# Altium schematic sheet Sheet1.SchDoc
size 420 x 297 mm; Scale: None
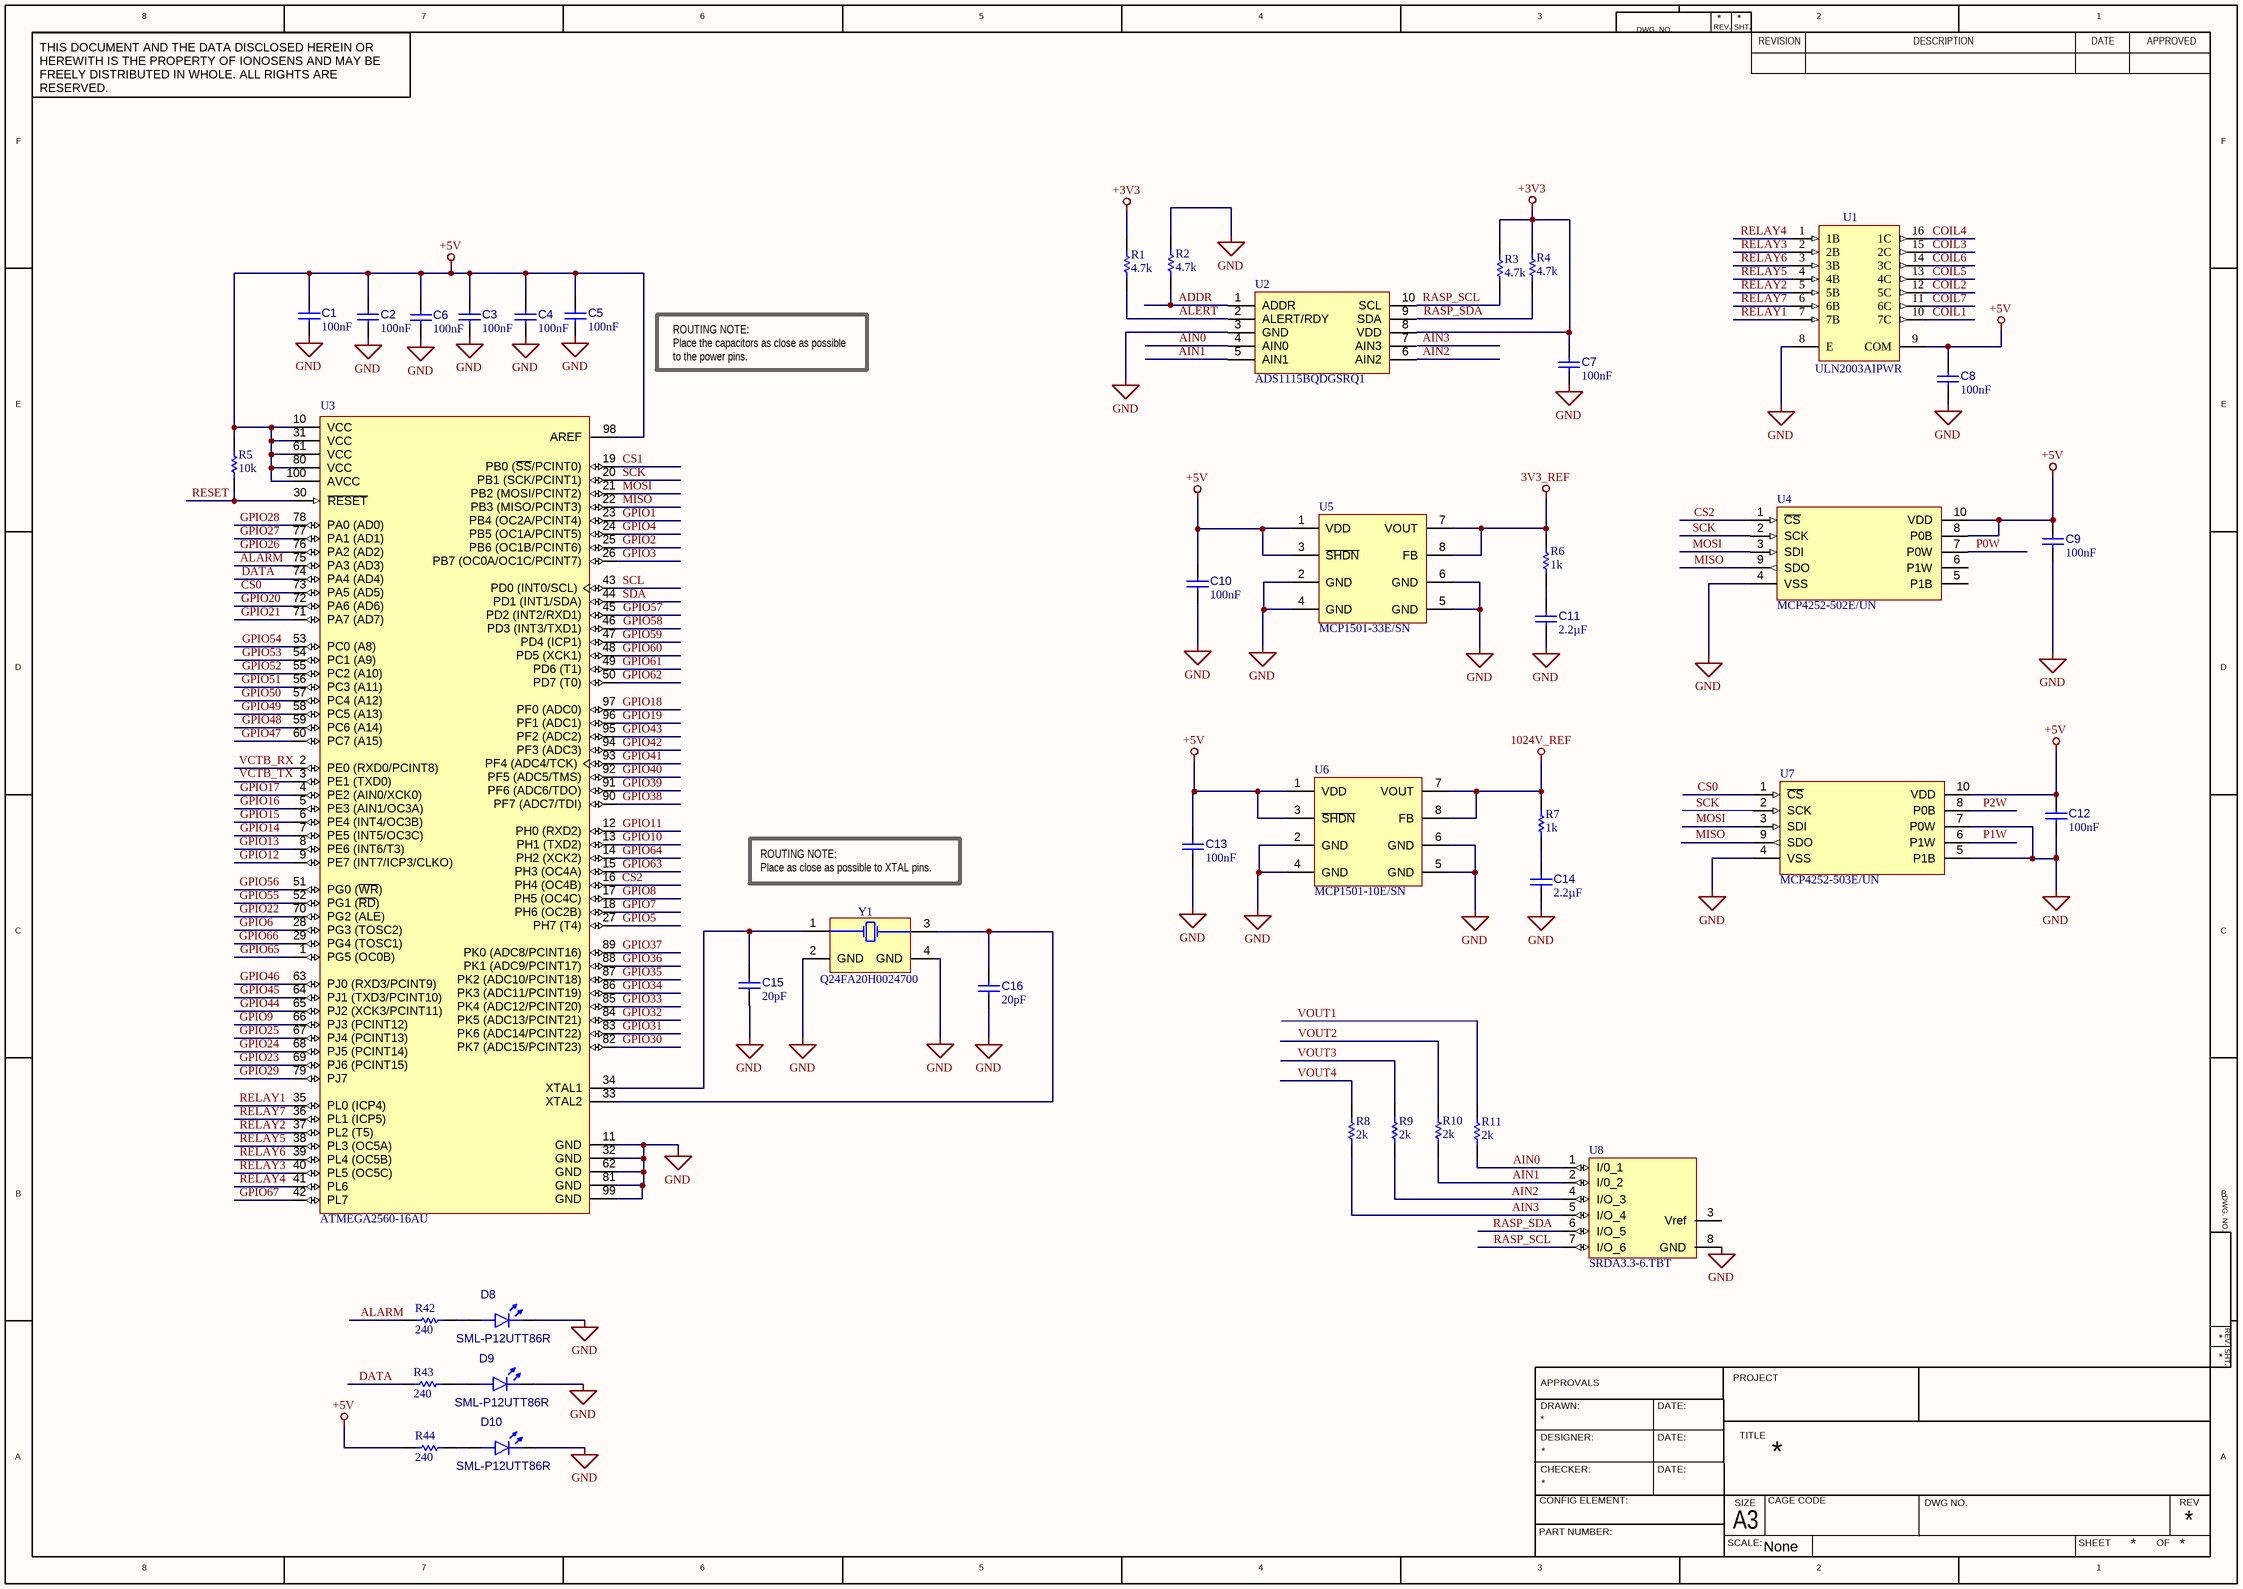
[diagram p0: Sheet1.SchDoc]

## Parts
C1  value 100nF  [CAPC1005X06M]  (hidden comment: CC0402JRX7R7BB104)
C2  value 100nF  [CAPC1005X06M]  (hidden comment: CC0402JRX7R7BB104)
C3  value 100nF  [CAPC1005X06M]  (hidden comment: CC0402JRX7R7BB104)
C4  value 100nF  [CAPC1005X06M]  (hidden comment: CC0402JRX7R7BB104)
C5  value 100nF  [CAPC1005X06M]  (hidden comment: CC0402JRX7R7BB104)
C6  value 100nF  [CAPC1005X06M]  (hidden comment: CC0402JRX7R7BB104)
C7  value 100nF  [CAPC1005X06M]  (hidden comment: CC0402JRX7R7BB104)
C8  value 100nF  [CAPC1005X06M]  (hidden comment: CC0402JRX7R7BB104)
C9  value 100nF  [CAPC1005X06M]  (hidden comment: CC0402JRX7R7BB104)
C10  value 100nF  [CAPC1005X06M]  (hidden comment: CC0402JRX7R7BB104)
C11  value 2.2µF  [CAPC2012X14M]  (hidden comment: AC0805KKX7R8BB225)
C12  value 100nF  [CAPC1005X06M]  (hidden comment: CC0402JRX7R7BB104)
C13  value 100nF  [CAPC1005X06M]  (hidden comment: CC0402JRX7R7BB104)
C14  value 2.2µF  [CAPC2012X14M]  (hidden comment: AC0805KKX7R8BB225)
C15  value 20pF  [CAPC1005X06M]  (hidden comment: CC0402JRNPO9BN200)
C16  value 20pF  [CAPC1005X06M]  (hidden comment: CC0402JRNPO9BN200)
D8  SML-P12UTT86R  [DIOC1005X02R]
D9  SML-P12UTT86R  [DIOC1005X02R]
D10  SML-P12UTT86R  [DIOC1005X02R]
R1  value 4.7k  [RESC1005X04M]  (hidden comment: AC0402FR-074K7L)
R2  value 4.7k  [RESC1005X04M]  (hidden comment: AC0402FR-074K7L)
R3  value 4.7k  [RESC1005X04M]  (hidden comment: AC0402FR-074K7L)
R4  value 4.7k  [RESC1005X04M]  (hidden comment: AC0402FR-074K7L)
R5  value 10k  [RESC1005X04M]  (hidden comment: AC0402FR-0710KL)
R6  value 1k  [RESC1005X04M]  (hidden comment: AC0402FR-071KL)
R7  value 1k  [RESC1005X04M]  (hidden comment: AC0402FR-071KL)
R8  value 2k  [RESC1005X04M]  (hidden comment: AC0402FR-072KL)
R9  value 2k  [RESC1005X04M]  (hidden comment: AC0402FR-072KL)
R10  value 2k  [RESC1005X04M]  (hidden comment: AC0402FR-072KL)
R11  value 2k  [RESC1005X04M]  (hidden comment: AC0402FR-072KL)
R42  value 240  [RESC1005X04M]  (hidden comment: AC0402FR-07240RL)
R43  value 240  [RESC1005X04M]  (hidden comment: AC0402FR-07240RL)
R44  value 240  [RESC1005X04M]  (hidden comment: AC0402FR-07240RL)
U1  ULN2003AIPWR  [TSOP65P640X120-16M]
U2  ADS1115BQDGSRQ1  [TSSOP50P490X110-10M]
U3  ATMEGA2560-16AU  [ATML-100A_M]
U4  MCP4252-502E/UN  [TSSOP50P490X110-10N]
U5  MCP1501-33E/SN  [SOIC127P600X175-8M]
U6  MCP1501-10E/SN  [SOIC127P600X175-8M]
U7  MCP4252-503E/UN  [TSSOP50P490X110-10N]
U8  SRDA3.3-6.TBT  [SOIC127P600X175-8M]
Y1  Q24FA20H0024700  [FA-20H]

## Nets
3V3_REF: R6.2 U5.7(VOUT) U5.8(FB)
1024V_REF: R7.2 U6.7(VOUT) U6.8(FB)
+3V3: C7.2 R1.2 R3.2 R4.2 U2.8(VDD)
+5V: C1.2 C2.2 C3.2 C4.2 C5.2 C6.2 C8.2 C9.2 C10.2 C12.2 C13.2 R5.2 R44.1 U1.9(COM) U3.10(VCC) U3.31(VCC) U3.61(VCC) U3.80(VCC) U3.98(AREF) U3.100(AVCC) U4.8(P0B) U4.10(VDD) U5.1(VDD) U5.3(~{SHDN}) U6.1(VDD) U6.3(~{SHDN}) U7.10(VDD)
GND: C1.1 C2.1 C3.1 C4.1 C5.1 C6.1 C7.1 C8.1 C9.1 C10.1 C11.1 C12.1 C13.1 C14.1 C15.1 C16.1 D8.1(K) D9.1(K) D10.1(K) R2.2 U1.8(E) U2.3(GND) U3.11(GND) U3.32(GND) U3.62(GND) U3.81(GND) U3.99(GND) U4.4(VSS) U5.2(GND) U5.4(GND) U5.5(GND) U5.6(GND) U6.2(GND) U6.4(GND) U6.5(GND) U6.6(GND) U7.4(VSS) U7.5(P1B) U7.7(P0W) U8.8(GND) Y1.2(GND) Y1.4(GND)
ADDR: R2.1 U2.1(ADDR)
AIN0: R11.2 U2.4(AIN0) U8.1(I/0_1)
AIN1: R10.1 U2.5(AIN1) U8.2(I/0_2)
AIN2: R9.1 U2.6(AIN2) U8.4(I/O_3)
AIN3: R8.1 U2.7(AIN3) U8.5(I/O_4)
ALARM: R42.1 U3.75(PA3_(AD3))
ALERT: R1.1 U2.2(ALERT/RDY)
COIL1: U1.10(7C)
COIL2: U1.12(5C)
COIL3: U1.15(2C)
COIL4: U1.16(1C)
COIL5: U1.13(4C)
COIL6: U1.14(3C)
COIL7: U1.11(6C)
CS0: U3.73(PA5_(AD5)) U7.1(~{CS})
CS1: U3.19(PB0_(~{SS}/PCINT0))
CS2: U3.16(PH4_(OC4B)) U4.1(~{CS})
DATA: R43.1 U3.74(PA4_(AD4))
GPIO1: U3.23(PB4_(OC2A/PCINT4))
GPIO2: U3.25(PB6_(OC1B/PCINT6))
GPIO3: U3.26(PB7_(OC0A/OC1C/PCINT7))
GPIO4: U3.24(PB5_(OC1A/PCINT5))
GPIO5: U3.27(PH7_(T4))
GPIO6: U3.28(PG3_(TOSC2))
GPIO7: U3.18(PH6_(OC2B))
GPIO8: U3.17(PH5_(OC4C))
GPIO9: U3.66(PJ3_(PCINT12))
GPIO10: U3.13(PH1_(TXD2))
GPIO11: U3.12(PH0_(RXD2))
GPIO12: U3.9(PE7_(INT7/ICP3/CLKO))
GPIO13: U3.8(PE6_(INT6/T3))
GPIO14: U3.7(PE5_(INT5/OC3C))
GPIO15: U3.6(PE4_(INT4/OC3B))
GPIO16: U3.5(PE3_(AIN1/OC3A))
GPIO17: U3.4(PE2_(AIN0/XCK0))
GPIO18: U3.97(PF0_(ADC0))
GPIO19: U3.96(PF1_(ADC1))
GPIO20: U3.72(PA6_(AD6))
GPIO21: U3.71(PA7_(AD7))
GPIO22: U3.70(PG2_(ALE))
GPIO23: U3.69(PJ6_(PCINT15))
GPIO24: U3.68(PJ5_(PCINT14))
GPIO25: U3.67(PJ4_(PCINT13))
GPIO26: U3.76(PA2_(AD2))
GPIO27: U3.77(PA1_(AD1))
GPIO28: U3.78(PA0_(AD0))
GPIO29: U3.79(PJ7)
GPIO30: U3.82(PK7_(ADC15/PCINT23))
GPIO31: U3.83(PK6_(ADC14/PCINT22))
GPIO32: U3.84(PK5_(ADC13/PCINT21))
GPIO33: U3.85(PK4_(ADC12/PCINT20))
GPIO34: U3.86(PK3_(ADC11/PCINT19))
GPIO35: U3.87(PK2_(ADC10/PCINT18))
GPIO36: U3.88(PK1_(ADC9/PCINT17))
GPIO37: U3.89(PK0_(ADC8/PCINT16))
GPIO38: U3.90(PF7_(ADC7/TDI))
GPIO39: U3.91(PF6_(ADC6/TDO))
GPIO40: U3.92(PF5_(ADC5/TMS))
GPIO41: U3.93(PF4_(ADC4/TCK))
GPIO42: U3.94(PF3_(ADC3))
GPIO43: U3.95(PF2_(ADC2))
GPIO44: U3.65(PJ2_(XCK3/PCINT11))
GPIO45: U3.64(PJ1_(TXD3/PCINT10))
GPIO46: U3.63(PJ0_(RXD3/PCINT9))
GPIO47: U3.60(PC7_(A15))
GPIO48: U3.59(PC6_(A14))
GPIO49: U3.58(PC5_(A13))
GPIO50: U3.57(PC4_(A12))
GPIO51: U3.56(PC3_(A11))
GPIO52: U3.55(PC2_(A10))
GPIO53: U3.54(PC1_(A9))
GPIO54: U3.53(PC0_(A8))
GPIO55: U3.52(PG1_(~{RD}))
GPIO56: U3.51(PG0_(~{WR}))
GPIO57: U3.45(PD2_(INT2/RXD1))
GPIO58: U3.46(PD3_(INT3/TXD1))
GPIO59: U3.47(PD4_(ICP1))
GPIO60: U3.48(PD5_(XCK1))
GPIO61: U3.49(PD6_(T1))
GPIO62: U3.50(PD7_(T0))
GPIO63: U3.15(PH3_(OC4A))
GPIO64: U3.14(PH2_(XCK2))
GPIO65: U3.1(PG5_(OC0B))
GPIO66: U3.29(PG4_(TOSC1))
GPIO67: U3.42(PL7)
MISO: U3.22(PB3_(MISO/PCINT3)) U4.9(SDO) U7.9(SDO)
MOSI: U3.21(PB2_(MOSI/PCINT2)) U4.3(SDI) U7.3(SDI)
P0W: U4.7(P0W)
P1W: U7.6(P1W)
P2W: U7.8(P0B)
RASP_SCL: R3.1 U2.10(SCL) U8.7(I/O_6)
RASP_SDA: R4.1 U2.9(SDA) U8.6(I/O_5)
RELAY1: U1.7(7B) U3.35(PL0_(ICP4))
RELAY2: U1.5(5B) U3.37(PL2_(T5))
RELAY3: U1.2(2B) U3.40(PL5_(OC5C))
RELAY4: U1.1(1B) U3.41(PL6)
RELAY5: U1.4(4B) U3.38(PL3_(OC5A))
RELAY6: U1.3(3B) U3.39(PL4_(OC5B))
RELAY7: U1.6(6B) U3.36(PL1_(ICP5))
RESET: R5.1 U3.30(~{RESET})
SCK: U3.20(PB1_(SCK/PCINT1)) U4.2(SCK) U7.2(SCK)
SCL: U3.43(PD0_(INT0/SCL))
SDA: U3.44(PD1_(INT1/SDA))
VCTB_RX: U3.2(PE0_(RXD0/PCINT8))
VCTB_TX: U3.3(PE1_(TXD0))
VOUT1: R11.1
VOUT2: R10.2
VOUT3: R9.2
VOUT4: R8.2
NetC11_2: C11.2 R6.1
NetC14_2: C14.2 R7.1
NetC15_2: C15.2 U3.34(XTAL1) Y1.1(X1)
NetC16_2: C16.2 U3.33(XTAL2) Y1.3(X2)
NetD8_2: D8.2(A) R42.2
NetD9_2: D9.2(A) R43.2
NetD10_2: D10.2(A) R44.2

Not connected (* = marked no-connect by the designer): U4 5(P1B) 6(P1W); U8 3(Vref)

## Notes on the sheet
- ROUTING NOTE:
  Place the capacitors as close as possible to the power pins.
- (near Y1) ROUTING NOTE:
  Place as close as possible to XTAL pins.
- 8
- 7
- 6
- 5
- 4
- 3
- DWG. NO.
- REV.
- SHT.
- REVISION
- 2
- DESCRIPTION
- DATE
- 1
- APPROVED
- THIS DOCUMENT AND THE DATA DISCLOSED HEREIN OR HEREWITH IS THE PROPERTY OF IONOSENS AND MAY BE FREELY DISTRIBUTED IN WHOLE. ALL RIGHTS ARE RESERVED.
- F
- E
- D
- C
- B
- DRAWN:
- APPROVALS
- DATE:
- PROJECT
- A
- CHECKER:
- DESIGNER:
- TITLE
- PART NUMBER:
- CONFIG ELEMENT:
- SCALE:
- A3
- SIZE
- CAGE CODE
- DWG NO.
- SHEET
- OF
- REV

## Library data of the parts
C1-C10 C12 C13 = C01-0402-01-00001-1: Cap Ceramic 100nF 50V X7R 5% SMD 0402 125°C; Manufacturer: YAGEO; Voltage Rating: 16V; Case/Package: 0402; Capacitor Type: Ceramic; Min Operating Temperature: -55°C; Width: 508µm; Length: 1mm; Tolerance: 5%; Dielectric: X7R; RoHS Compliant: Yes; Pins: 2; Composition: Ceramic; Depth: 500µm; Voltage Rating (DC): 16V; Mount: Surface Mount; Mounting Technology: Surface Mount; Termination: SMD/SMT; Manufacturer P/N: CC0402JRX7R7BB104; Thickness: 558.8µm; Max Operating Temperature: 125°C
C11 C14 = C01-0402-01-00007-1: Cap Ceramic 2.2uF 25V X7R +-10% SMD 0805 125°C; Manufacturer: YAGEO; Tolerance: 10%; Dielectric: XR7; Max Operating Temperature: 125°C; Composition: Ceramic; Min Operating Temperature: -55°C; Thickness: 711.2µm; Depth: 1.25mm; RoHS Compliant: Yes; Width: 1.2466mm; Mounting Technology: Surface Mount; Case/Package: 0805; Termination: SMD/SMT; Voltage Rating: 25V; Pins: 2; Mount: Surface Mount; Manufacturer P/N: AC0805KKX7R8BB225; Capacitor Type: Ceramic; Length: 2mm; Voltage Rating (DC): 25V
C15 C16 = C01-0402-01-00008-1: Cap Ceramic 20pF 50V C0G 5% SMD 0402 125°C; Manufacturer: YAGEO; Dielectric: COG; Case/Package: 0402; Tolerance: 5%; Thickness: 558.8µm; Termination: SMD/SMT; Manufacturer P/N: CC0402JRNPO9BN200; Voltage Rating: 50V; Length: 990.6µm; Depth: 500µm; Width: 508µm; Min Operating Temperature: -55°C; Mount: Surface Mount; Voltage Rating (DC): 50V; Pins: 2; Capacitor Type: Ceramic; RoHS Compliant: Yes; Composition: Ceramic; Mounting Technology: Surface Mount; Max Operating Temperature: 125°C
D8-D10 = D01-0402-01-00001-1: Led red 0402; Manufacturer: ROHM; Number of LEDs: 1; Max Power Dissipation: 52mW; Luminous Intensity: 85 mcd; Dominant Wavelength: 620 nm; Lens Style: Rectangular, Square; Forward Current: 20 mA; Forward Voltage: 2V; Mounting Technology: SMD; Case/Package: 0402; Min Operating Temperature: -40°C; Max Operating Temperature: 85°C; Manufacturer P/N: SML-P12UTT86R; Colour: red; RoHS Compliant: Yes; Pins: 2
R1-R4 = R01-0402-01-00105-2: RES SMD 4.7K OHM 1% 1/16W 0402; Manufacturer: Yageo; Temperature Coefficient: 100 ppm/ºC; Power Rating: 62.5mW; Voltage Rating: 50V; Width: 508µm; Max Operating Temperature: 155°C; Manufacturer P/N: AC0402FR-074K7L; Features: Automotive AEC-Q200, Moisture Resistant; Number of Terminations: 2; Height: 370µm; Min Operating Temperature: -55°C; Case/Package: 0402; Tolerance: 1%; RoHS: Yes; Packaging: Tape & Reel; Composition: Thick Film; Length: 990.6µm
R5 = R01-0402-01-00169-2: RES SMD 10K OHM 1% 1/16W 0402; Manufacturer: Yageo; Temperature Coefficient: 100 ppm/ºC; Power Rating: 62.5mW; Voltage Rating: 50V; Length: 990.6µm; Height: 370µm; Min Operating Temperature: -55°C; Case/Package: 0402; Features: Automotive AEC-Q200, Moisture Resistant; Packaging: Tape & Reel; Width: 508µm; Manufacturer P/N: AC0402FR-0710KL; RoHS: Yes; Max Operating Temperature: 155°C; Tolerance: 1%; Composition: Thick Film; Number of Terminations: 2
R6 R7 = R01-0402-01-00029-2: RES SMD 1K OHM 1% 1/16W 0402; Manufacturer: Yageo; Power Rating: 62.5mW; Voltage Rating: 50V; Temperature Coefficient: 100 ppm/ºC; Length: 990.6µm; Case/Package: 0402; Features: Automotive AEC-Q200, Moisture Resistant; RoHS: Yes; Packaging: Tape & Reel; Min Operating Temperature: -55°C; Composition: Thick Film; Width: 508µm; Number of Terminations: 2; Tolerance: 1%; Height: 370µm; Manufacturer P/N: AC0402FR-071KL; Max Operating Temperature: 155°C
R8-R11 = R01-0402-01-00067-3: RES SMD 2K OHM 1% 1/16W 0402; Manufacturer: Yageo; Voltage Rating: 50V; Power Rating: 62.5mW; Temperature Coefficient: 100 ppm/ºC; Tolerance: 1%; Length: 990.6µm; Width: 508µm; Number of Terminations: 2; Packaging: Tape & Reel; Composition: Thick Film; RoHS: Yes; Height: 370µm; Case/Package: 0402; Manufacturer P/N: AC0402FR-072KL; Features: Automotive AEC-Q200, Moisture Resistant; Min Operating Temperature: -55°C; Max Operating Temperature: 155°C
R42-R44 = R01-0402-01-00437-2: RES SMD 240 OHM 1% 1/16W 0402; Manufacturer: Yageo; Temperature Coefficient: 100 ppm/ºC; Power Rating: 62.5mW; Voltage Rating: 50V; Packaging: Tape & Reel; Manufacturer P/N: AC0402FR-07240RL; Height: 370µm; Case/Package: 0402; Composition: Thick Film; Max Operating Temperature: 155°C; Number of Terminations: 2; RoHS: Yes; Min Operating Temperature: -55°C; Tolerance: 1%; Width: 508µm; Length: 990.6µm; Features: Automotive AEC-Q200, Moisture Resistant
U1 = CMP-0005-0001-00001-1: 50-V, 7-ch darlington transistor array, -40 to 105C 16-TSSOP -40 to 105; Manufacturer: Texas Instruments; Voltage Rating: 50V; Min Operating Temperature: 105°C; RoHS Compliant: yes; Pins: 16; Case/Package: TSSOP; Mounting Technology: SMD; Length: 5mm; Manufacturer P/N: ULN2003AIPWR; Height: 1.2mm; Max Operating Temperature: -40°C; Width: 4.4mm
U2 = CMP-0015-00000-5: 4-Channel Single ADC Delta-Sigma 860sps 16-bit Serial Automotive 10-Pin VSSOP; Manufacturer: Texas Instrument; Channels: 4; Interface: I2C; Min Operating Temperature: -40°C; Mounting Technology: SMD; RoHS Compliant: yes; Pins: 10; Manufacturer P/N: ADS1115BQDGSRQ1; Max Operating Temperature: 125°C; Case/Package: VSSOP10
U3 = U01-0007-01-00000-1: AVR ATmega Microcontroller 8-bit 16MHz 256KB FLASH TQFP100; Manufacturer: Microchip; Oscillator Type: External; Interface: I2C, SPI, UART; Minimum Supply Voltage: 4.5V; Peripherals: Brown-out Detect/Reset, POR, PWM, WDT; Number of A/D: 1 AD / 16 channels; Watchdog Timer: Yes; Number of I/O: 86; RAM Size: 8KB; Max Supply Voltage: 5.5V; Max Operating Temperature: 85°C; Manufacturer P/N: ATMEGA2560-16AU; Memory Size: 256KB; Mounting Technology: SMD; Memory Type: FLASH; Pins: 100; Height: 1.2mm; Case/Package: A; RoHS: Yes; Min Operating Temperature: -40°C; Max Frequency: 16MHz; Number of Programmable I/O: 86; Contact Plating: Tin; Core Architecture: AVR; Frequency: 16MHz; Width: 16.25mm
U4 = CMP-0005-0002-00000-2: Digital Potentiometer 5kOhm 256POS Volatile Linear Automotive 10-Pin MSOP; Manufacturer: Microchip; Temperature Coefficient: 150 ppm/°C; Number of Positions: 256; Tolerance: 20%; Number of Elements: 2; Min Supply Voltage: 1.8V; Max Supply Voltage: 5.5V; Resistance: 5k; Interface: SPI; Length: 3mm; Min Operating Temperature: -40°C; Pins: 10; Manufacturer P/N: MCP4252-502E/UN; RoHS Compliant: yes; Memory Type: Volatile; Case/Package: MSOP; Mount: SMD; Mounting Technology: SMD; Max Operating Temperature: 125°C; Height: 950µm; Width: 3mm
U5 = CMP-019-00050-1: V-Ref Precision 3.3V 20mA 8-Pin SOIC; Manufacturer: Microchip; Temperature Coefficient: 50 ppm/°C; Min Supply Voltage: 1.65V; Max Supply Voltage: 5.5V; Tolerance: 0.1 %; Output Voltage: 3.3V; Min Operating Temperature: -40°C; Max Operating Temperature: 125°C; Case/Package: SOIC; Pins: 8; Output Current: 20 mA; RoHS Compliant: yes; Mounting Technology: SMD; Manufacturer P/N: MCP1501-33E/SN
U6 = CMP-019-00049-1: V-Ref Precision 1.024V 20mA 8-Pin SOIC; Manufacturer: Microchip; Min Supply Voltage: 1.65V; Output Voltage: 1.024kV; Tolerance: 0.1 %; Max Supply Voltage: 5.5V; Temperature Coefficient: 50 ppm/°C; Min Operating Temperature: -40°C; Case/Package: SOIC; Pins: 8; Max Operating Temperature: 125°C; Manufacturer P/N: MCP1501-10E/SN; RoHS Compliant: yes; Mounting Technology: SMD; Output Current: 20 mA
U7 = CMP-0005-0002-00001-2: Digital Potentiometer 50kOhm 256POS Volatile Linear Automotive 10-Pin MSOP; Manufacturer: Microchip; Temperature Coefficient: 150 ppm/°C; Tolerance: 20%; Number of Positions: 256; Min Supply Voltage: 1.8V; Interface: SPI; Max Supply Voltage: 5.5V; Resistance: 50k; Number of Elements: 2; Length: 3mm; Max Operating Temperature: 125°C; Case/Package: MSOP; Manufacturer P/N: MCP4252-503E/UN; RoHS Compliant: yes; Mounting Technology: SMD; Memory Type: Volatile; Min Operating Temperature: -40°C; Width: 3mm; Pins: 10; Mount: SMD; Height: 950µm
U8 = CMP-0005-0001-00000-1: SRDA Series 15 V 8 pF SMT RailClamp® Low Capacitance TVS Diode Array - SOIC-8; Manufacturer: Semtech; Number of Channels: 6; Peak Pulse Current: 25A; Max Breakdown Voltage: 6V; Max Power Dissipation: 500W; Direction: Unidirectional; Clamping Voltage: 15V; Capacitance: 8pF; Breakdown Voltage: 3.2V; Leakage Current: 1µV; Manufacturer P/N: SRDA3.3-6.TBT; Height: 1.75mm; Case/Package: so-8; Pins: 8; Length: 5mm; Min Operating Temperature: -55°C; Mounting Technology: SMD; Max Operating Temperature: 125°C; RoHS Compliant: yes; Width: 4mm
Y1 = Y01-0001-01-00000-11: 16MHz ±10ppm 16pF 80Ω SMD-2520_4P; Manufacturer: SEIKO-EPSON; ESR: 80; RoHS Compliant: yes; Min Operating Temperature: -40°C; Load Capacitance: 16pF; Mounting Technology: SMD; Pins: 4; Case/Package: SMD-2520_4P; Max Operating Temperature: 85°C; Frequency: 16MHz; Manufacturer P/N: Q24FA20H0024700